# EAGLE design Arduinoboy (EAGLE 7.3.0)
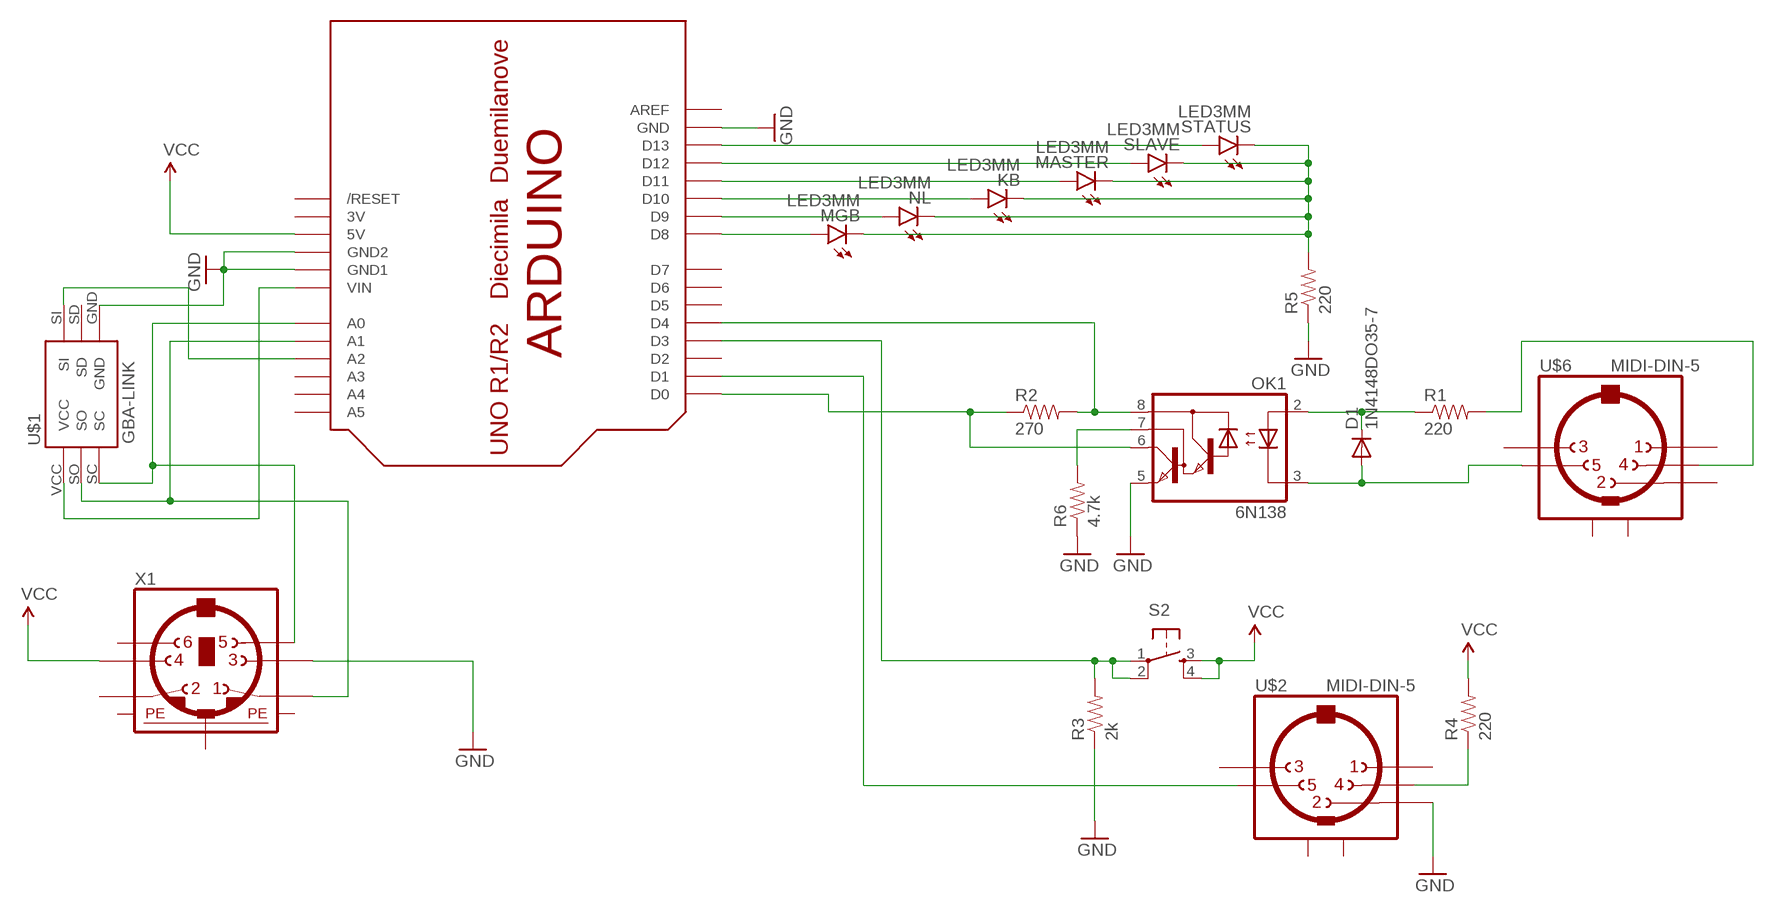
[diagram p0: schematic, sheet 1]

## Parts
D1  1N4148DO35-7  [DO35-7]
KB  LED3MM  [LED3MM]
MASTER  LED3MM  [LED3MM]
MGB  LED3MM  [LED3MM]
NL  LED3MM  [LED3MM]
OK1  6N138  [DIL08]
R1  220  RESISTORAXIAL-0.3  [AXIAL-0.3]
R2  270  RESISTORAXIAL-0.3  [AXIAL-0.3]
R3  2k  RESISTORAXIAL-0.3  [AXIAL-0.3]
R4  220  RESISTORAXIAL-0.3  [AXIAL-0.3]
R5  220  RESISTORAXIAL-0.3  [AXIAL-0.3]
R6  4.7k  RESISTORAXIAL-0.3  [AXIAL-0.3]
S2  TAC_SWITCHPTH  [TACTILE-PTH]
SLAVE  LED3MM  [LED3MM]
STATUS  LED3MM  [LED3MM]
U$1  GBA-LINK  [GBA-LINK]
U$2  MIDI-DIN-5  [MIDI-DIN-5]
U$3  ARDUINOUNO  [ARDUINO]
U$6  MIDI-DIN-5  [MIDI-DIN-5]
X1  MINI_DIN_6  [M_DIN6]

## Nets
GND: OK1.5(GND) R3.P$1 R5.P$1 R6.P$1 U$1.GND U$2.2 U$3.GND U$3.GND1 U$3.GND2 X1.3
N$1: D1.C OK1.2(A) R1.P$1
N$2: D1.A OK1.3(C) U$6.5
N$4: R3.P$2 S2.1 S2.2 U$3.D3
N$5: R4.P$1 U$2.4
N$6: MGB.A U$3.D8
N$7: U$2.5 U$3.D1
N$8: NL.A U$3.D9
N$9: OK1.8(VCC) R2.P$2 U$3.D4
N$10: OK1.6(VO) R2.P$1 U$3.D0
N$11: KB.A U$3.D10
N$12: MASTER.A U$3.D11
N$13: SLAVE.A U$3.D12
N$14: STATUS.A U$3.D13
N$15: KB.K(C) MASTER.K(C) MGB.K(C) NL.K(C) R5.P$2 SLAVE.K(C) STATUS.K(C)
N$16: OK1.7(VB) R6.P$2
N$17: U$1.SC U$3.A0 X1.5
N$18: U$1.VCC U$3.VIN
N$19: R1.P$2 U$6.4
N$21: U$1.SO U$3.A1 X1.1
N$22: U$1.SI U$3.A2
VCC: R4.P$2 S2.3 S2.4 U$3.5V X1.4
Unconnected: U$1.SD U$2.1 U$2.3 U$2.PE1 U$2.PE2 U$2.PE11(PE1) U$2.PE22(PE2) U$3.A3 U$3.A4 U$3.A5 U$3.AREF U$3.D2 U$3.D5 U$3.D6 U$3.D7 U$3.RESET(/RESET) U$6.1 U$6.2 U$6.3 U$6.PE1 U$6.PE2 U$6.PE11(PE1) U$6.PE22(PE2) X1.2 X1.6

## Power pins joined to a net without a drawn wire
3V: U$3.3V
PE1: X1.SH1(PE1)
PE2: X1.SH2(PE2)
PE3: X1.SH3(PE3)

## Library data of the parts
D1 = diode:1N4148: DIODE high speed (Philips)
KB MASTER MGB NL SLAVE STATUS = gm-diodes:LED
OK1 = optocoupler:6N138: MOTOROLA OPTO COUPLER
R1-R6 = SparkFun-Resistors:RESISTOR: Resistor Basic schematic elements and footprints for 0603, 1206, and PTH resistors.
S2 = SparkFun-Retired:TAC_SWITCH: Momentary Switch Button commonly used for reset or general input. Spark Fun Electronics SKU : COM-00097 SMT- SWCH-08247
U$1 = David:GBA-LINK
U$2 U$6 = MIDI by Jazz:MIDI-DIN-5
U$3 = adafruit_modif:ARDUINO: Arduino Diecimila/Duemilanove Make a shield with ease, this package has all the named pins as well as the two mounting drill holes and an outline of the USB and DC power connector. The outline is on the DIMENSION layer, so if your board house uses it they will cut the outline to match. http://www.ladyada.net/library/pcb/eaglelibrary.html
X1 = mini_din:MINI_DIN_6

## Board
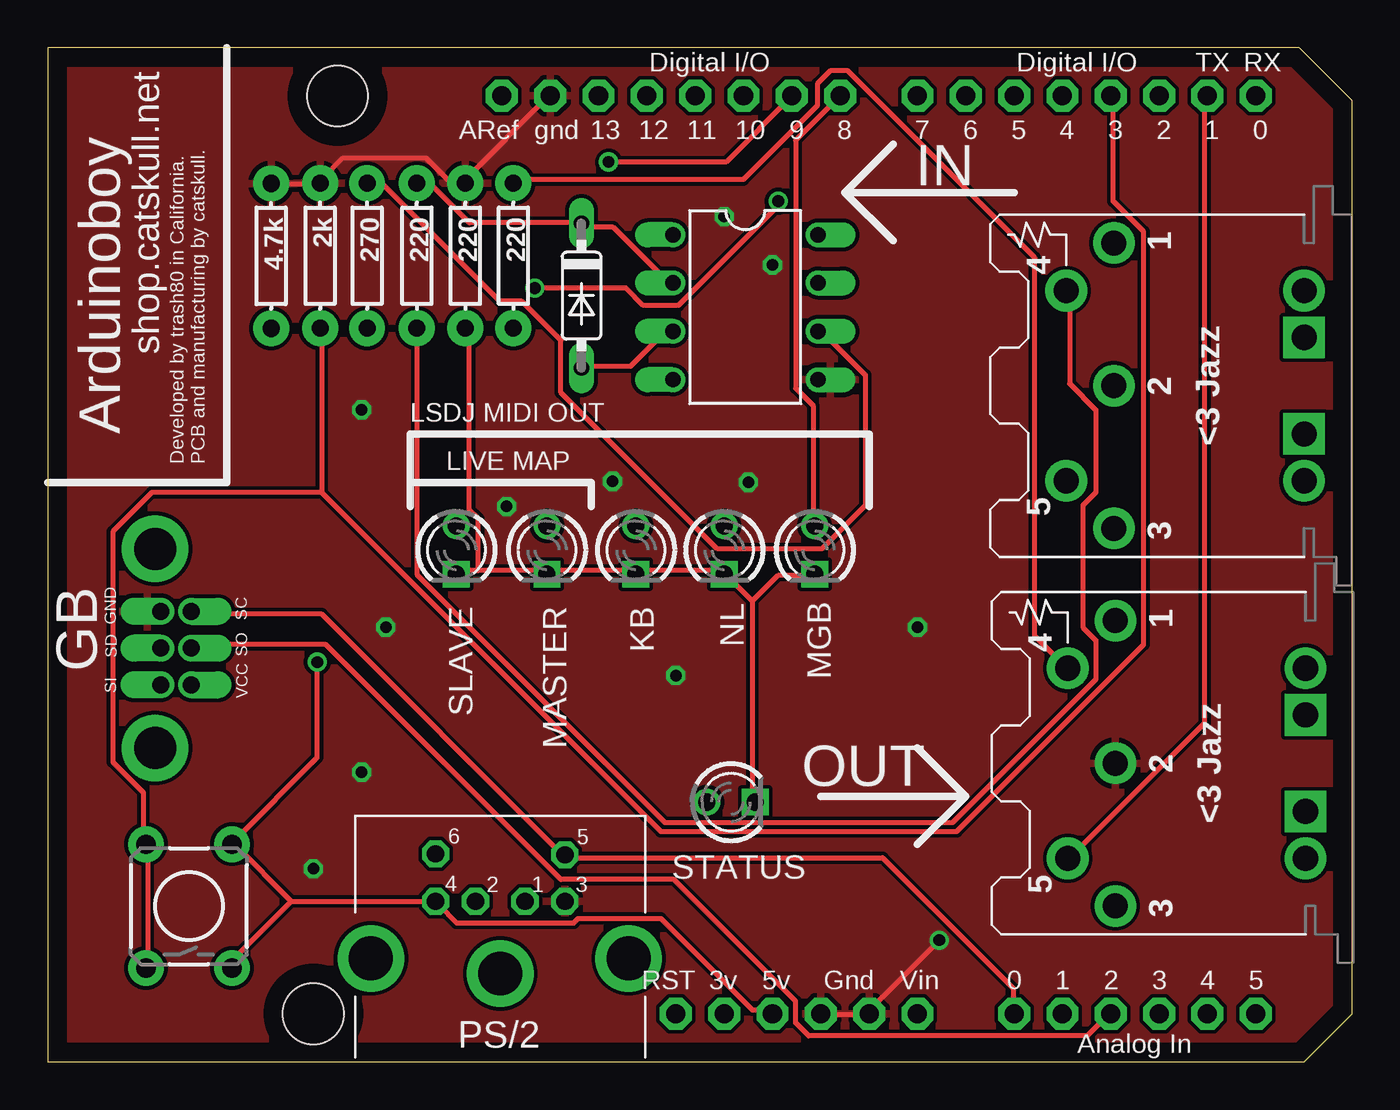
[diagram p1: board, top side]
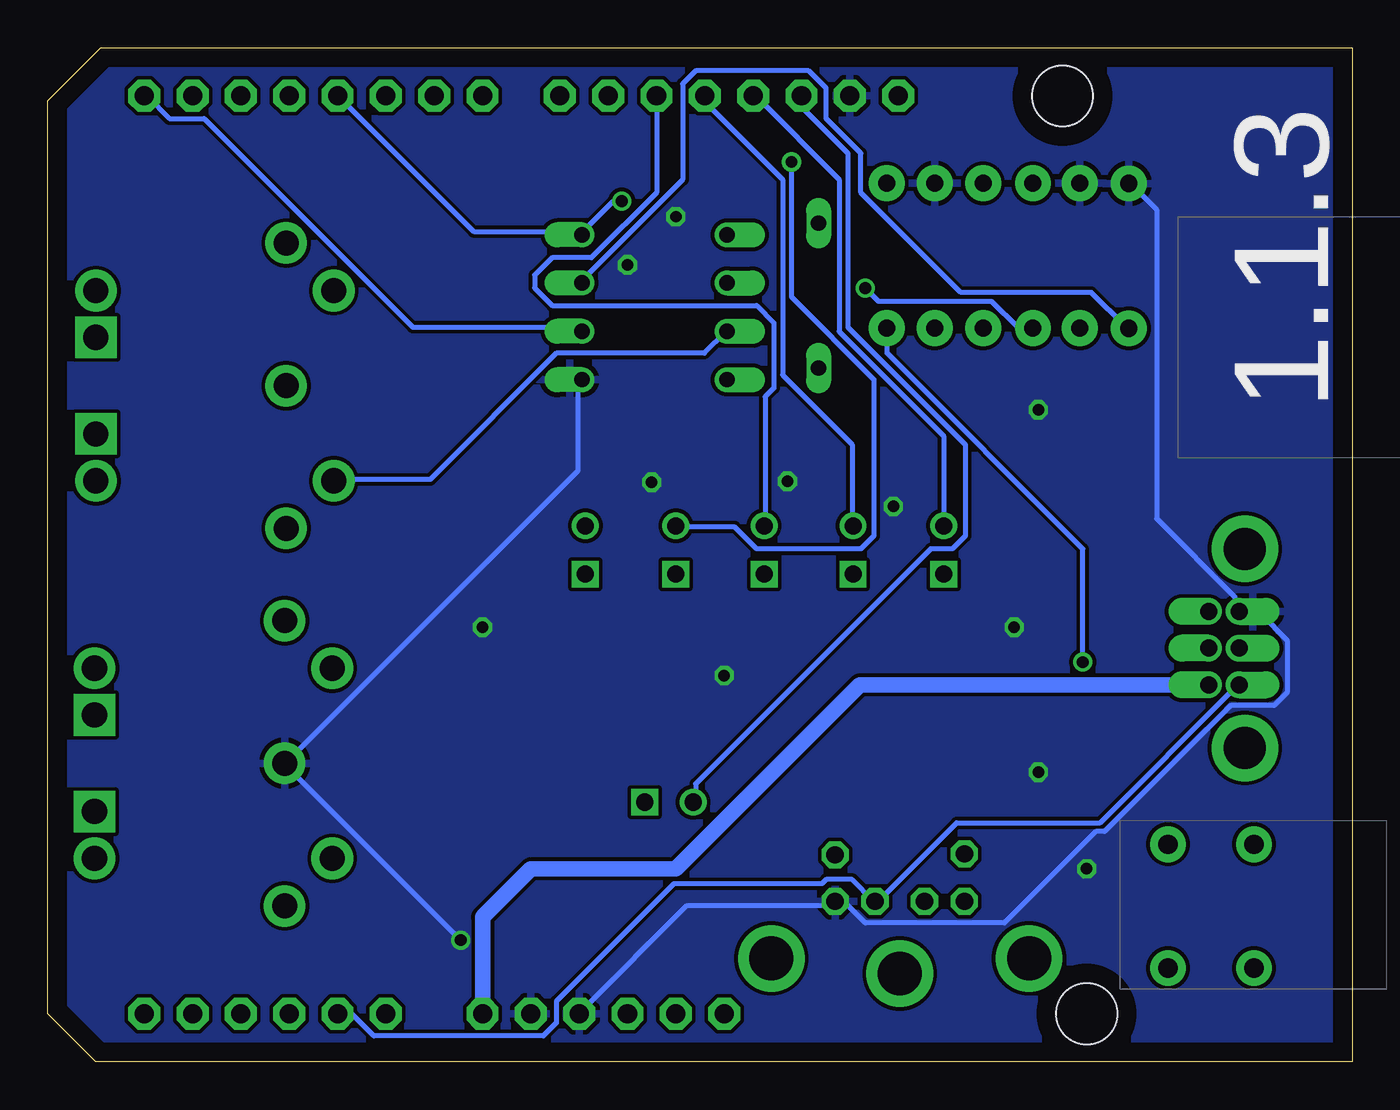
[diagram p2: board, bottom side, seen from below]

Size 68.58 x 53.34 mm. Coordinates in mm from the lower left corner, seen from the top.
Copper layers (1*16): Top 0.035mm / dielectric 1.5mm / Bottom 0.035mm
Design rules "default": minimum track width 10mil, minimum drill 24mil, track to track 8mil, track to pad 8mil, pad to pad 8mil, via to via 8mil, smd to smd 8mil, copper to edge 40mil, drill to drill 8mil, minimum pad ring 10mil, minimum via ring 8mil, stop-mask expansion 4mil, vias tented up to drill 0mil, thermal gap 10mil

### Footprints (pad centres in the part's own frame; a part is rotated, then mirrored left to right if it is on the bottom)
DO35-7 = drill 0.813 long: A 3.81,0; C -3.81,0
LED3MM = drill 0.9: A -1.27,0 | drill 0.9 square: K 1.27,0
DIL08 = drill 0.813 offset: 1 -3.81,-3.81; 2 -1.27,-3.81; 3 1.27,-3.81; 4 3.81,-3.81; 5 3.81,3.81; 6 1.27,3.81; 7 -1.27,3.81; 8 -3.81,3.81
AXIAL-0.3 = drill 0.9 pad 1.88: P$1 -3.81,0; P$2 3.81,0
TACTILE-PTH = drill 1.016 pad 1.88: 1 -3.251,2.261; 2 3.251,2.261; 3 -3.251,-2.261; 4 3.251,-2.261
GBA-LINK = drill 0.9 pad 1.27 offset: GND 7.18,1.67; SC 7.18,0.06; SD 5.25,1.67; SI 5.25,0.06; SO 3.32,1.67; VCC 3.32,0.06 | drill 2.2 pad 3.5: SHEILD1 0,1.965; SHEILD2 10.47,1.965
MIDI-DIN-5 = drill 1.321 pad 2.184: 1 -7.5,-10; 2 0,-10; 3 7.5,-10; 4 -5,-12.5; 5 5,-12.5; PE1 5,0; PE2 -5,0 | drill 1.321 pad 2.184 square: PE11 2.54,0; PE22 -2.54,0
ARDUINO = drill 1 pad 1.676 octagon: 3V 35.56,2.54; 5V 38.1,2.54; A0 50.8,2.54; A1 53.34,2.54; A2 55.88,2.54; A3 58.42,2.54; A4 60.96,2.54; A5 63.5,2.54; AREF 23.876,50.8; D0 63.5,50.8; D1 60.96,50.8; D2 58.42,50.8; D3 55.88,50.8; D4 53.34,50.8; D5 50.8,50.8; D6 48.26,50.8; D7 45.72,50.8; D8 41.656,50.8; D9 39.116,50.8; D10 36.576,50.8; D11 34.036,50.8; D12 31.496,50.8; D13 28.956,50.8; GND 26.416,50.8; GND1 43.18,2.54; GND2 40.64,2.54; RESET 33.02,2.54; VIN 45.72,2.54 | hole 3.2: 15.24,50.8; 13.97,2.54
M_DIN6 = drill 0.9 pad 1.422 octagon: 1 -1.3,-3.75; 2 1.3,-3.75; 3 -3.4,-3.75; 4 3.4,-3.75; 5 -3.4,-6.2; 6 3.4,-6.25 | drill 2.3 pad 3.5: SH1 6.8,-0.75; SH2 0,0.05; SH3 -6.75,-0.75

### Placement (x,y rotation side)
D1  28.06,40.3 270 top
KB  30.92,26.92 270 top
MASTER  26.24,26.92 270 top
MGB  40.32,26.92 270 top
NL  35.56,26.92 270 top
OK1  36.67,39.69 270 top
R1  19.41,42.39 270 top
R2  16.79,42.39 270 top
R3  14.33,42.39 270 top
R4  24.48,42.39 270 top
R5  21.95,42.39 270 top
R6  11.75,42.38 270 top
S2  7.43,8.19 90 top
SLAVE  21.48,26.92 270 top
STATUS  35.92,13.67 0 top
U$1  7.62,16.51 90 top
U$2  66.12,15.71 270 top
U$3  0,0 0 top
U$6  66.04,35.56 270 top
X1  23.79,4.7 180 top

### Tracks (layer width: path | path; a pad name or v marks a point on that pad's centre or on a via)
GND  (via drill 0.6, 0.61)
  Top 0.254: U$3.GND2 40.69,2.52 42.98,2.52 U$3.GND1 43.2,2.74 v46.86,6.4 | 21.95,46.41 26.29,50.75 U$3.GND | R6.P$1 11.89,46.18 14.17,46.18 R3.P$1 14.4,46.41 15.54,47.55 19.89,47.55 21.03,46.41 21.95,46.41 | 21.95,46.41 R5.P$1
  Bottom 0.254: OK1.5 40.69,35.66 40.69,31.09 56.01,15.77 U$2.2 56.01,15.54 v46.86,6.4 | U$3.GND2 40.46,2.74 34.98,8.23 27.2,8.23 X1.3 26.98,8.23 26.52,8.23 25.6,7.32 18.29,7.32 13.49,12.12 13.03,12.12 6.4,18.75 4.12,18.75 3.43,19.43 3.43,22.17 4.8,23.55 5.94,23.55 U$1.GND 6.17,23.77 6.17,24.46 10.29,28.57 10.29,44.81 11.66,46.18 R6.P$1
  other vias: 13.97,10.16 16.51,15.24 45.72,22.86 36.83,30.48 16.51,34.29 33.02,20.32 38.1,41.91 35.56,44.45 24.13,29.21 29.69,30.53 17.78,22.86
  pour Top: 0,53.34 66.04,53.34 68.58,50.8 68.58,2.54 66.04,0 0,0
  pour Bottom: 0,53.34 66.04,53.34 68.58,50.8 68.58,2.54 66.04,0 0,0
N$1
  Top 0.254: OK1.2 32.69,40.92 29.72,43.89 28.12,43.89 D1.C 27.89,44.12 22.17,44.12 20.12,46.18 19.43,46.18 R1.P$1
N$2
  Top 0.254: D1.A 28.12,36.58 30.63,36.58 32.69,38.63 OK1.3
  Bottom 0.254: U$6.5 53.49,30.63 48.46,30.63 41.83,37.26 34.06,37.26 32.92,38.41 OK1.3
N$4
  Top 0.254: S2.1 5.26,5.03 5.26,11.43 S2.2 5.03,11.66 5.03,14.17 3.43,15.77 3.43,27.89 5.49,29.95 14.4,29.95 | 14.4,29.95 32.23,12.12 47.78,12.12 57.61,21.95 57.61,43.66 56.01,45.26 56.01,50.75 U$3.D3 | 14.4,29.95 14.4,38.41 R3.P$2
N$5
  Top 0.254: R4.P$1 24.69,46.41 36.58,46.41 40.46,50.29 40.46,51.44 41.15,52.12 42.06,52.12 51.89,42.29 51.89,22.4 53.49,20.8 U$2.4
N$6
  Top 0.254: U$3.D8 39.32,48.46 39.32,35.43 40.23,34.52 40.23,28.35 MGB.A
N$7
  Top 0.254: U$3.D1 60.81,50.75 60.81,17.83 53.72,10.74 U$2.5
N$8  (via drill 0.61)
  Top 0.254: v29.49,47.32 35.66,47.32 39.09,50.75 U$3.D9
  Bottom 0.254: v29.49,47.32 29.49,40.23 25.15,35.89 25.15,27.66 25.83,26.98 31.32,26.98 32.46,28.12 35.43,28.12 NL.A
N$9  (via drill 0.61)
  Top 0.254: v25.6,40.69 30.4,40.69 31.32,39.78 33.15,39.78 38.41,45.03 v38.41,45.26
  Bottom 0.254: U$3.D4 53.26,50.75 46.18,43.66 40.69,43.66 OK1.8 40.46,43.66 38.86,45.26 v38.41,45.26 | v25.6,40.69 24.92,40.01 18.97,40.01 17.6,38.63 16.92,38.63 R2.P$2
N$10
  Top 0.254: R2.P$1 16.92,46.18 17.6,46.18 23.77,40.01 24.92,40.01 26.98,37.95 26.98,35.2 35.2,26.98 40.69,26.98 42.98,29.26 42.98,36.12 40.69,38.41 OK1.6
  Bottom 0.254: OK1.6 40.69,38.63 49.38,38.63 60.35,49.61 62.18,49.61 63.32,50.75 U$3.D0
N$11
  Bottom 0.254: U$3.D10 36.58,45.72 40.01,42.29 42.06,42.29 42.98,41.38 42.98,40.69 42.06,39.78 31.32,39.78 30.4,38.86 30.4,35.43 30.86,34.98 30.86,28.35 KB.A
N$12
  Bottom 0.254: MASTER.A 26.29,28.35 26.29,32.46 29.95,36.12 29.95,46.41 33.83,50.29 33.83,50.75 U$3.D11
N$13
  Bottom 0.254: SLAVE.A 21.49,28.35 21.49,32.92 26.98,38.41 26.98,46.41 31.32,50.75 U$3.D12
N$14
  Bottom 0.254: STATUS.A 34.52,13.72 34.52,14.63 22.17,26.98 21.03,26.98 20.34,27.66 20.34,32.46 26.52,38.63 26.52,47.78 28.8,50.06 28.8,50.75 U$3.D13
N$15
  Top 0.254: 22.63,25.83 26.06,25.83 MASTER.K 26.29,25.83 30.86,25.83 KB.K 31.09,25.83 35.43,25.83 NL.K 35.66,25.6 37.03,24.23 | 22.63,25.83 21.49,25.83 SLAVE.K | 22.63,25.83 22.63,28.57 22.17,29.03 22.17,38.41 R5.P$2 | 37.03,24.23 37.03,13.72 STATUS.K | 37.03,24.23 38.41,25.6 40.23,25.6 MGB.K
N$16
  Bottom 0.254: OK1.7 40.46,41.15 35.2,46.41 35.2,51.44 34.52,52.12 28.57,52.12 27.66,51.21 27.66,49.61 25.83,47.78 25.83,45.72 20.57,40.46 13.72,40.46 11.89,38.63 R6.P$2
N$17
  Top 0.254: U$1.SC 7.77,23.55 14.4,23.55 26.98,10.97 X1.5 27.2,10.74 43.89,10.74 50.75,3.89 50.75,2.74 U$3.A0
N$18
  Bottom 0.813: U$1.VCC 25.89,19.83 35.56,10.16 43.18,10.16 45.72,7.62 U$3.VIN
N$19
  Top 0.254: R1.P$2 19.43,38.41 19.43,25.6 32.46,12.57 47.55,12.57 55.09,20.12 55.09,22.17 54.41,22.86 54.41,29.26 55.09,29.95 55.09,34.29 53.72,35.66 53.72,40.46 U$6.4
N$21
  Bottom 0.254: U$1.SO 6.17,19.66 13.26,12.57 20.8,12.57 24.92,8.46 X1.1 25.15,8.46 26.29,9.6 27.66,9.6 27.89,9.37 35.66,9.37 41.83,3.2 41.83,2.06 42.52,1.37 51.44,1.37 52.58,2.52 53.26,2.52 U$3.A1
N$22
  Top 0.254: U$1.SI 7.77,21.95 14.63,21.95 26.98,9.6 32.92,9.6 39.32,3.2 39.32,2.06 40.01,1.37 54.63,1.37 55.78,2.52 U$3.A2
VCC  (via drill 0.61)
  Top 0.254: 12.8,8.46 20.34,8.46 X1.4 20.57,8.23 21.49,7.32 27.66,7.32 27.89,7.54 32.23,7.54 37.03,2.74 37.95,2.74 U$3.5V | 12.8,8.46 9.83,11.43 S2.4 9.83,11.66 14.17,16 v14.17,21.03 | 12.8,8.46 9.83,5.49 9.83,5.03 S2.3
  Bottom 0.254: v14.17,21.03 14.17,26.98 24.46,37.26 24.46,38.41 R4.P$2

### Text on the board
tNames: shop.catskull.net | TX | RX | IN | LSDJ MIDI OUT | Arduinoboy | Developed by trash80 in California. / PCB and manufacturing by catskull. | LIVE MAP | GB | OUT | PS/2
bNames: 1.1.3